# EAGLE design Propeller-HAT (EAGLE 6.6.0)
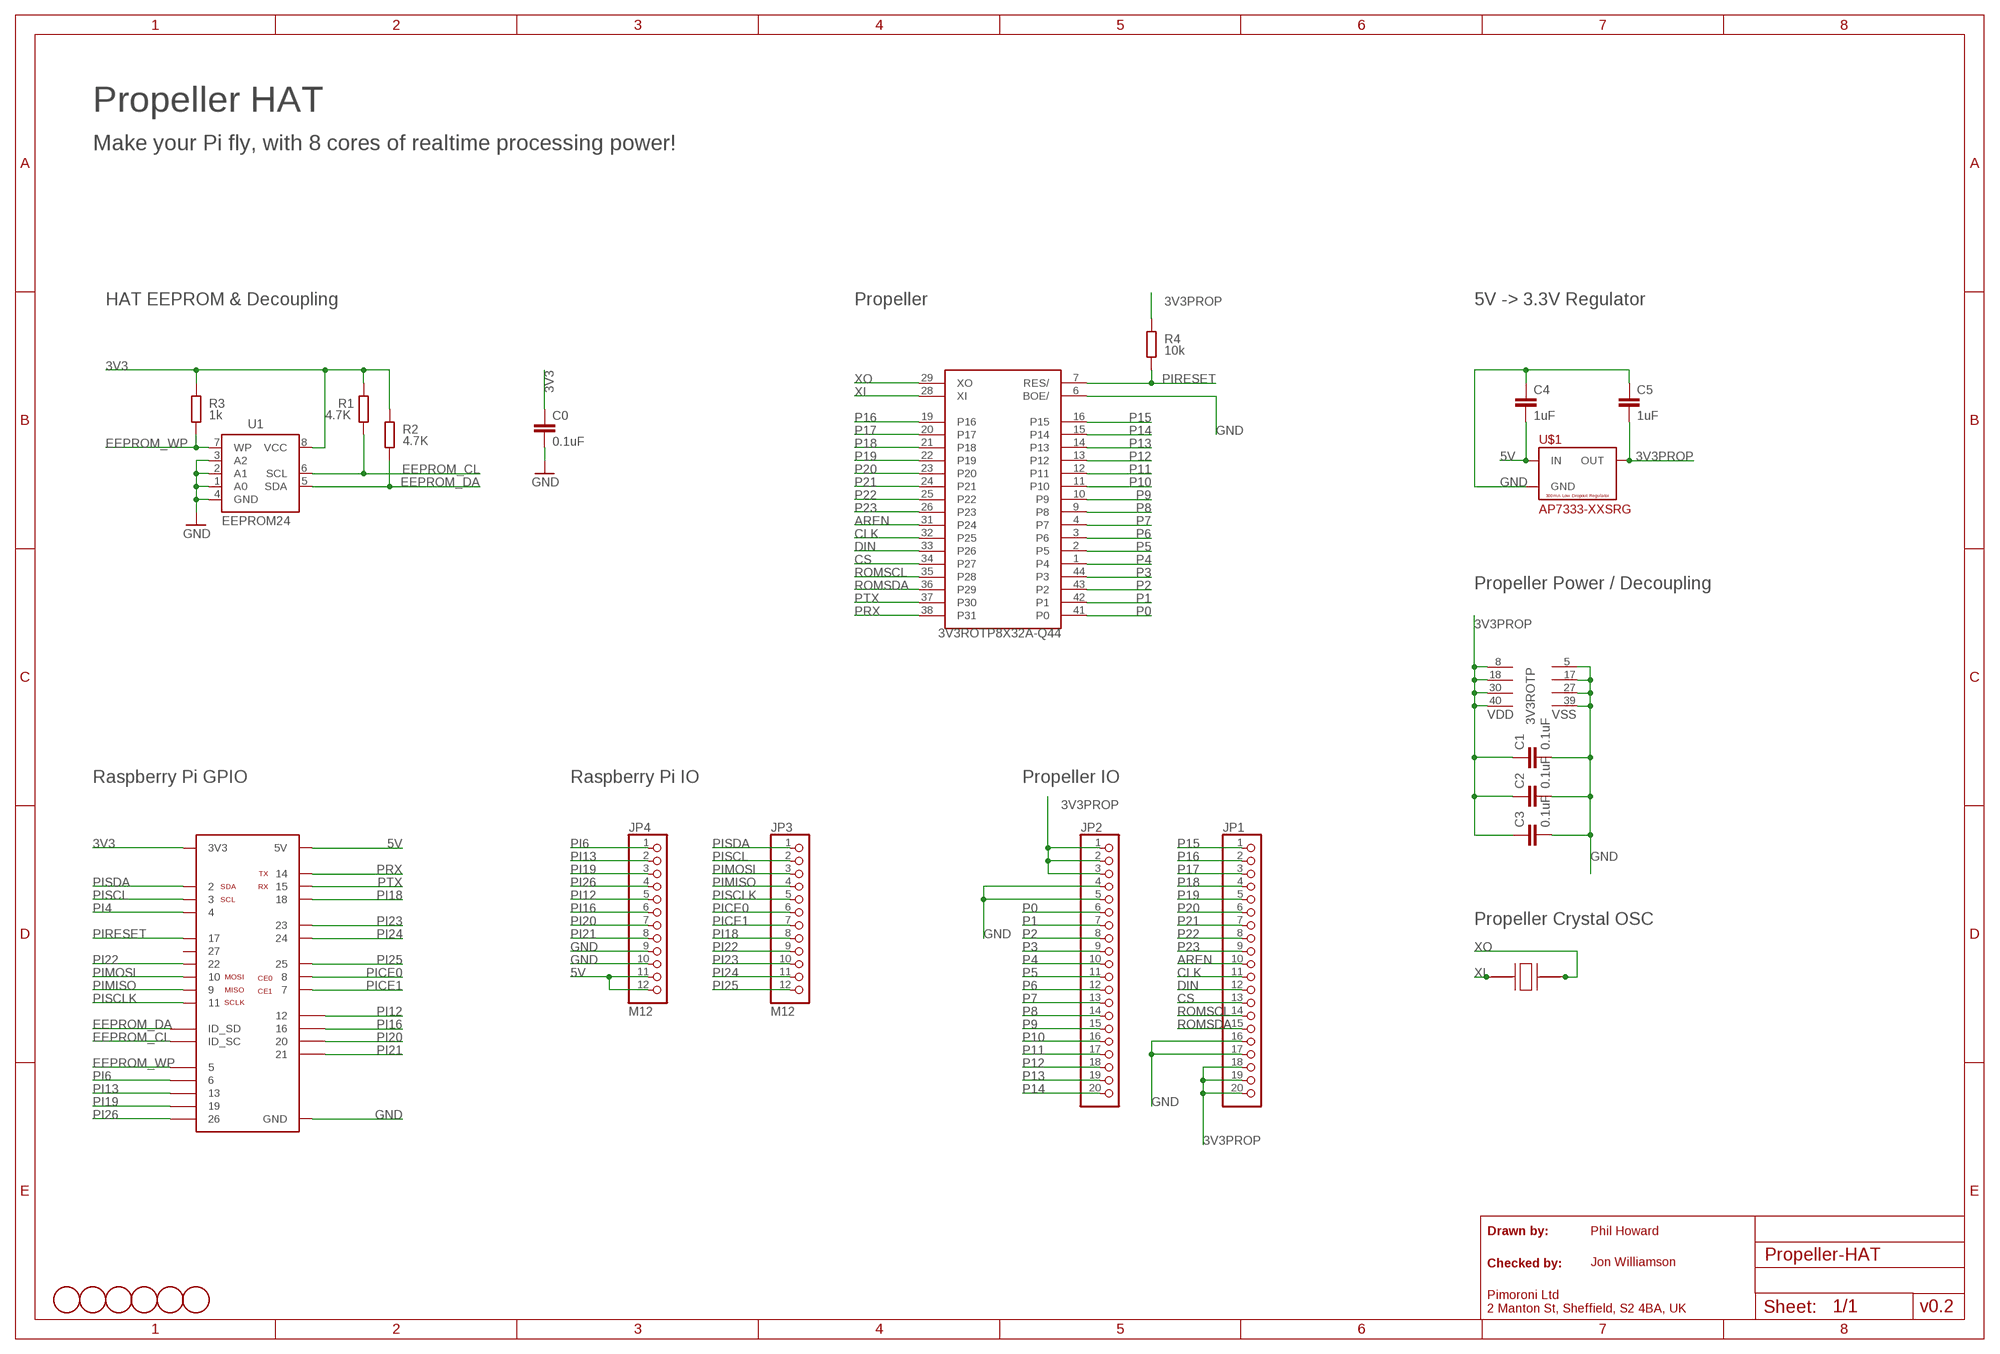
[diagram p0: schematic, sheet 1]

## Parts
3V3ROT  P8X32A-Q44  [P8X32A-Q44]
C0  0.1uF  C-EUC0603K  [C0603K]
C1  0.1uF  C-EUC0603K  [C0603K]
C2  0.1uF  C-EUC0603K  [C0603K]
C3  0.1uF  C-EUC0603K  [C0603K]
C4  1uF  C-EUC0603K  [C0603K]
C5  1uF  C-EUC0603K  [C0603K]
JP1  PINHD-1X20-BIG  [1X20-BIG]
JP2  PINHD-1X20-BIG  [1X20-BIG]
JP3  M12  [M12]
JP4  M12  [M12]
R1  4.7K  R-EU_R0603  [R0603]
R2  4.7K  R-EU_R0603  [R0603]
R3  1k  R-EU_R0603  [R0603]
R4  10k  R-EU_R0603  [R0603]
U1  EEPROM24  [SOIC8]
U$1  AP7333-XXSRG  [SOT23]
U$2  RPIGPIOPINHD-2X20-SMD-FLIPPED  [FCI_89898_313LF_40P_CONNECTOR_SMT_FLIPPED]
U$3  FIDUCIAL1MM  [FIDUCIAL-1MM]
U$4  FIDUCIAL1MM  [FIDUCIAL-1MM]
U$5  FIDUCIAL1MM  [FIDUCIAL-1MM]
U$6  FIDUCIAL1MM  [FIDUCIAL-1MM]
U$7  FIDUCIAL1MM  [FIDUCIAL-1MM]
U$8  FIDUCIAL1MM  [FIDUCIAL-1MM]
U$9  ABLS3-XXXMHZ-D4Y-T  [ABLS3-XXXMHZ-D4Y-T]

## Nets
3V3: C0.1 R1.2 R2.2 R3.2 U1.8(VCC) U$2.P1_3V3(3V3) U$2.P17_3V3(3V3)
3V3PROP: 3V3ROT.8(P:VDD) 3V3ROT.18(P:VDD) 3V3ROT.30(P:VDD) 3V3ROT.40(P:VDD) C1.1 C2.1 C3.1 C5.2 JP1.18 JP1.19 JP1.20 JP2.1 JP2.2 JP2.3 R4.2 U$1.2(OUT)
5V: C4.2 JP4.11 JP4.12 U$1.3(IN) U$2.P2_5V(5V) U$2.P4_5V(5V)
AREN: 3V3ROT.31(P8X32A-Q44:P24) JP1.10
CLK: 3V3ROT.32(P8X32A-Q44:P25) JP1.11
CS: 3V3ROT.34(P8X32A-Q44:P27) JP1.13
DIN: 3V3ROT.33(P8X32A-Q44:P26) JP1.12
EEPROM_CL: R1.1 U1.6(SCL) U$2.P28_IDSC(ID_SC)
EEPROM_DA: R2.1 U1.5(SDA) U$2.P27_IDSD(ID_SD)
EEPROM_WP: R3.1 U1.7(WP) U$2.P29_GPIO5
GND: 3V3ROT.5(P:VSS) 3V3ROT.6(P8X32A-Q44:BOE/) 3V3ROT.17(P:VSS) 3V3ROT.27(P:VSS) 3V3ROT.39(P:VSS) C0.2 C1.2 C2.2 C3.2 C4.1 C5.1 JP1.16 JP1.17 JP2.4 JP2.5 JP4.9 JP4.10 U1.1(A0) U1.2(A1) U1.3(A2) U1.4(GND) U$1.1(GND) U$2.P6_GND(GND) U$2.P9_GND(GND) U$2.P14_GND(GND) U$2.P20_GND(GND) U$2.P25_GND(GND) U$2.P30_GND(GND) U$2.P34_GND(GND) U$2.P39_GND(GND)
P0: 3V3ROT.41(P8X32A-Q44:P0) JP2.6
P1: 3V3ROT.42(P8X32A-Q44:P1) JP2.7
P2: 3V3ROT.43(P8X32A-Q44:P2) JP2.8
P3: 3V3ROT.44(P8X32A-Q44:P3) JP2.9
P4: 3V3ROT.1(P8X32A-Q44:P4) JP2.10
P5: 3V3ROT.2(P8X32A-Q44:P5) JP2.11
P6: 3V3ROT.3(P8X32A-Q44:P6) JP2.12
P7: 3V3ROT.4(P8X32A-Q44:P7) JP2.13
P8: 3V3ROT.9(P8X32A-Q44:P8) JP2.14
P9: 3V3ROT.10(P8X32A-Q44:P9) JP2.15
P10: 3V3ROT.11(P8X32A-Q44:P10) JP2.16
P11: 3V3ROT.12(P8X32A-Q44:P11) JP2.17
P12: 3V3ROT.13(P8X32A-Q44:P12) JP2.18
P13: 3V3ROT.14(P8X32A-Q44:P13) JP2.19
P14: 3V3ROT.15(P8X32A-Q44:P14) JP2.20
P15: 3V3ROT.16(P8X32A-Q44:P15) JP1.1
P16: 3V3ROT.19(P8X32A-Q44:P16) JP1.2
P17: 3V3ROT.20(P8X32A-Q44:P17) JP1.3
P18: 3V3ROT.21(P8X32A-Q44:P18) JP1.4
P19: 3V3ROT.22(P8X32A-Q44:P19) JP1.5
P20: 3V3ROT.23(P8X32A-Q44:P20) JP1.6
P21: 3V3ROT.24(P8X32A-Q44:P21) JP1.7
P22: 3V3ROT.25(P8X32A-Q44:P22) JP1.8
P23: 3V3ROT.26(P8X32A-Q44:P23) JP1.9
PI4: U$2.P7_GPIO4
PI6: JP4.1 U$2.P31_GPIO6
PI12: JP4.5 U$2.P32_GPIO12
PI13: JP4.2 U$2.P33_GPIO13
PI16: JP4.6 U$2.P36_GPIO16
PI18: JP3.8 U$2.P12_GPIO18
PI19: JP4.3 U$2.P35_GPIO19
PI20: JP4.7 U$2.P38_GPIO20
PI21: JP4.8 U$2.P40_GPIO21
PI22: JP3.9 U$2.P15_GPIO22
PI23: JP3.10 U$2.P16_GPIO23
PI24: JP3.11 U$2.P18_GPIO24
PI25: JP3.12 U$2.P22_GPIO25
PI26: JP4.4 U$2.P37_GPIO26
PICE0: JP3.6 U$2.P24_GPIO8_SPI0_CE0
PICE1: JP3.7 U$2.P26_GPIO7_SPI0_CE1
PIMISO: JP3.4 U$2.P21_GPIO9_SPI0_MISO
PIMOSI: JP3.3 U$2.P19_GPIO10_SPI0_MOSI
PIRESET: 3V3ROT.7(P8X32A-Q44:RES/) R4.1 U$2.P11_GPIO17
PISCL: JP3.2 U$2.P5_GPIO3_SCL
PISCLK: JP3.5 U$2.P23_GPIO11_SPI0_SCLK
PISDA: JP3.1 U$2.P3_GPIO2_SDA
PRX: 3V3ROT.38(P8X32A-Q44:P31) U$2.P8_GPIO14_UART0_TXD
PTX: 3V3ROT.37(P8X32A-Q44:P30) U$2.P10_GPIO15_UART0_RXD
ROMSCL: 3V3ROT.35(P8X32A-Q44:P28) JP1.14
ROMSDA: 3V3ROT.36(P8X32A-Q44:P29) JP1.15
XI: 3V3ROT.28(P8X32A-Q44:XI) U$9.P$1
XO: 3V3ROT.29(P8X32A-Q44:XO) U$9.P$2
Unconnected: U$2.P13_GPIO27

## Notes on the sheet
- Propeller HAT
- Make your Pi fly, with 8 cores of realtime processing power!
- HAT EEPROM & Decoupling | Propeller | 5V -> 3.3V Regulator
- Propeller Power / Decoupling
- Raspberry Pi GPIO | Raspberry Pi IO | Propeller IO
- Propeller Crystal OSC
- Drawn by: | Phil Howard
- Checked by: | Jon Williamson
- Pimoroni Ltd
  2 Manton St, Sheffield, S2 4BA, UK
- v0.2

## Library data of the parts
3V3ROT = SparkFun-DigitalIC:P8X32A-Q44: Propellor uC
C0 C1-C5 = resistor:C-EU: CAPACITOR, European symbol
JP1 JP2 = adafruit:PINHD-1X20: PIN HEADER
JP3 JP4 = pimoroni:M12
R1-R4 = resistor:R-EU_: RESISTOR, European symbol; TOLERANCE: 5%
U1 = FLYFISH:EEPROM24
U$1 = pimoroni:AP7333: The AP7333 is a 300mA, fixed output voltage, low dropout linear regulator. The device included pass element, error amplifier, band-gap, current limit and thermal shutdown circuitry. The characteristics of low dropout voltage and low quiescent current make it suitable for low power applications, for example, battery powered devices. The typical quiescent current is approximately 65μA. Built-in current-limit and thermal-shutdown functions prevent IC from damage in fault conditions. The AP7333 is available in SOT23 packages with different pin-outs.
U$2 = pimoroni:RPIGPIOPINHD-2X20-SMD-FLIPPED
U$3-U$8 = pimoroni:FIDUCIAL: 2mm fiducial for pick and place
U$9 = pimoroni:ABLS3-XXXMHZ-D4Y-T

## Board
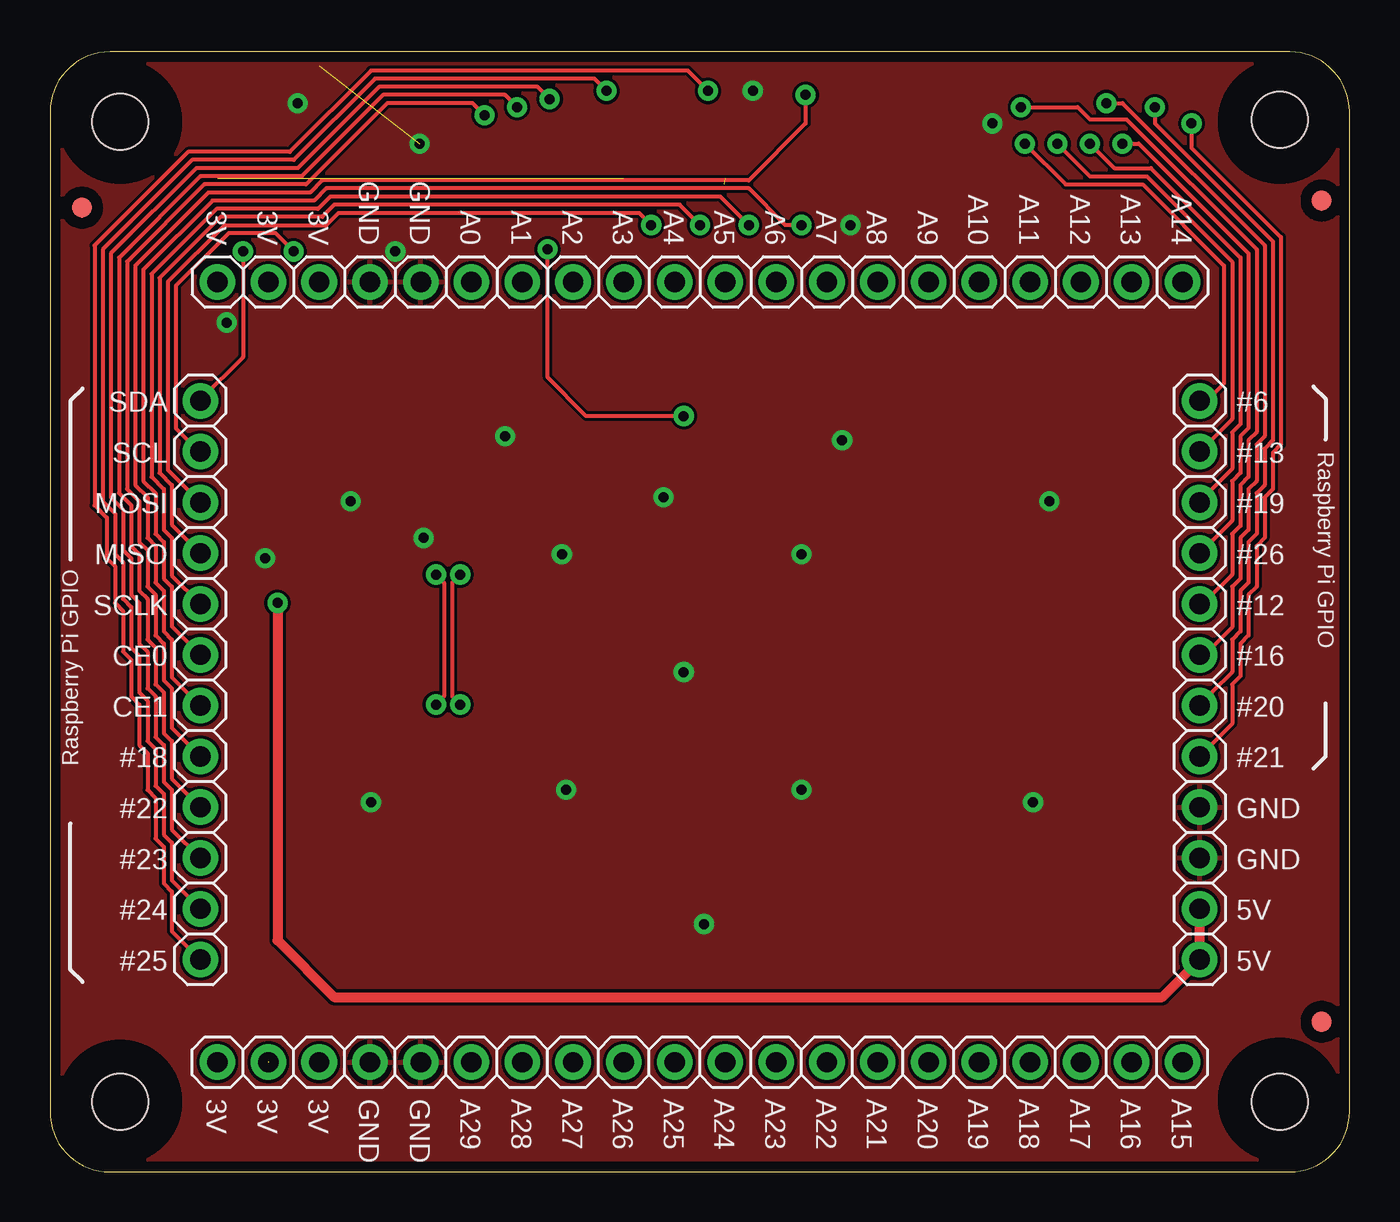
[diagram p1: board, top side]
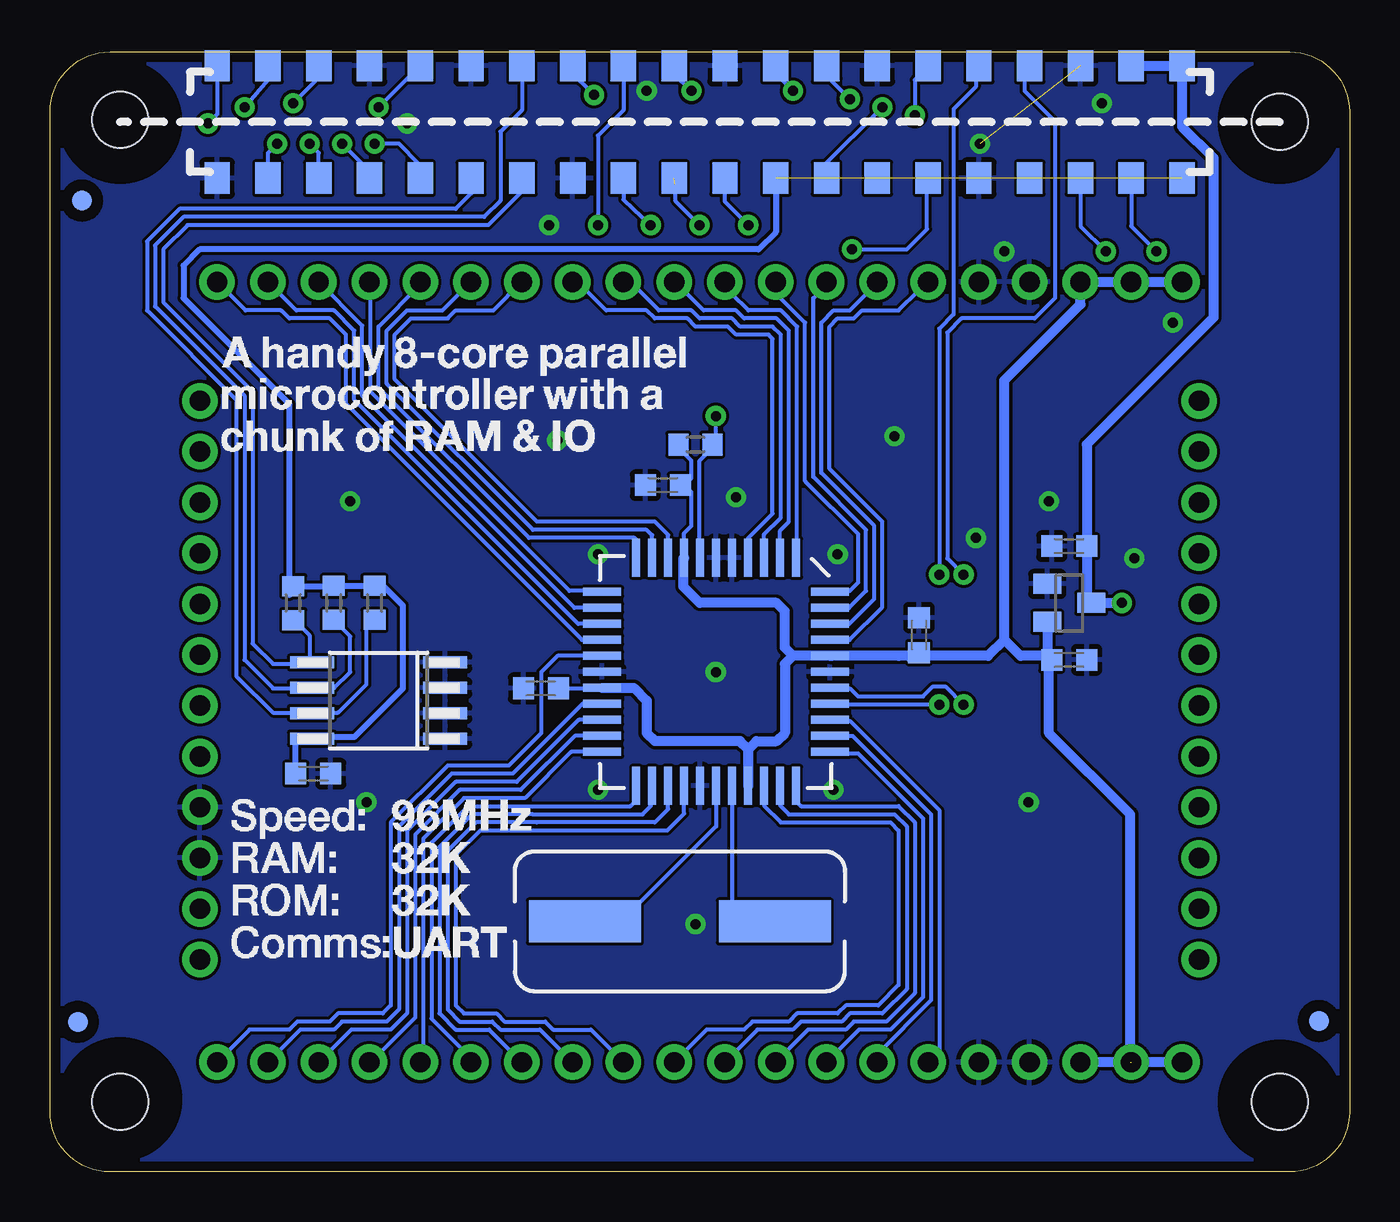
[diagram p2: board, bottom side, seen from below]

Size 65 x 56 mm. Coordinates in mm from the lower left corner, seen from the top.
Outline: 65,53 arc90 62,56 3,56 arc90 0,53 0,3 arc90 3,0 62,0 arc90 65,3 65,53
Copper layers (1*16): Top 0.035mm / dielectric 1.5mm / Bottom 0.035mm
Design rules "pimoroni": minimum track width 8mil, minimum drill 12mil, track to track 6mil, track to pad 6mil, pad to pad 6mil, via to via 6mil, smd to smd 6mil, copper to edge 20mil, drill to drill 6mil, minimum pad ring 12mil, minimum via ring 10mil, stop-mask expansion 1mil, vias tented up to drill 25mil, thermal gap 10mil
Holes 2.8 mm at 61.5,52.6 61.5,3.5 3.5,3.5 3.5,52.5
tRestrict: area 60,2 to 63,5.2; area 1.9,1.9 to 5,5; area 1.9,51 to 5,54; area 60,51 to 63,54.1
bRestrict: area 60,51 to 63,54; area 59.9,2.1 to 63,5.2; area 1.9,51 to 5,54; area 1.9,1.9 to 5,5

### Footprints (pad centres in the part's own frame; a part is rotated, then mirrored left to right if it is on the bottom)
P8X32A-Q44 = smd 1.9 x 0.4: 1 -5.713,4.013; 2 -5.713,3.212; 3 -5.713,2.413; 4 -5.713,1.613; 5 -5.713,0.812; 6 -5.713,0.013; 7 -5.713,-0.787; 8 -5.713,-1.587; 9 -5.713,-2.388; 10 -5.713,-3.188; 11 -5.713,-3.987; 23 5.688,-3.987; 24 5.688,-3.188; 25 5.688,-2.388; 26 5.688,-1.587; 27 5.688,-0.787; 28 5.688,0.013; 29 5.688,0.812; 30 5.688,1.613; 31 5.688,2.413; 32 5.688,3.212; 33 5.688,4.013 | smd 0.4 x 1.9: 12 -4.013,-5.688; 13 -3.212,-5.688; 14 -2.413,-5.688; 15 -1.613,-5.688; 16 -0.812,-5.688; 17 -0.013,-5.688; 18 0.787,-5.688; 19 1.587,-5.688; 20 2.388,-5.688; 21 3.188,-5.688; 22 3.987,-5.688; 34 3.987,5.713; 35 3.188,5.713; 36 2.388,5.713; 37 1.587,5.713; 38 0.787,5.713; 39 -0.013,5.713; 40 -0.812,5.713; 41 -1.613,5.713; 42 -2.413,5.713; 43 -3.212,5.713; 44 -4.013,5.713
C0603K = smd 1.05 x 1.08: 1 -0.875,0; 2 0.875,0
1X20-BIG = drill 1.016 pad 1.778: 1 -24.13,0; 2 -21.59,0; 3 -19.05,0; 4 -16.51,0; 5 -13.97,0; 6 -11.43,0; 7 -8.89,0; 8 -6.35,0; 9 -3.81,0; 10 -1.27,0; 11 1.27,0; 12 3.81,0; 13 6.35,0; 14 8.89,0; 15 11.43,0; 16 13.97,0; 17 16.51,0; 18 19.05,0; 19 21.59,0; 20 24.13,0
M12 = drill 1.016 pad 1.778: 1 -13.97,0; 2 -11.43,0; 3 -8.89,0; 4 -6.35,0; 5 -3.81,0; 6 -1.27,0; 7 1.27,0; 8 3.81,0; 9 6.35,0; 10 8.89,0; 11 11.43,0; 12 13.97,0
R0603 = smd 1 x 1.1: 1 -0.85,0; 2 0.85,0
SOIC8 = smd 0.6 x 2.2: 1 -1.905,-3.33; 2 -0.635,-3.33; 3 0.635,-3.33; 4 1.905,-3.33; 5 1.905,3.33; 6 0.635,3.33; 7 -0.635,3.33; 8 -1.905,3.33
SOT23 = smd 1 x 1.4: 1 -0.95,-1.1; 2 0.95,-1.1; 3 0,1.1
FCI_89898_313LF_40P_CONNECTOR_SMT_FLIPPED = smd 1.27 x 1.57: P1_3V3 24.13,-2.81; P2_5V 24.13,2.81; P3_GPIO2_SDA 21.59,-2.81; P4_5V 21.59,2.81; P5_GPIO3_SCL 19.05,-2.81; P6_GND 19.05,2.81; P7_GPIO4 16.51,-2.81; P8_GPIO14_UART0_TXD 16.51,2.81; P9_GND 13.97,-2.81; P10_GPIO15_UART0_RXD 13.97,2.81; P11_GPIO17 11.43,-2.81; P12_GPIO18 11.43,2.81; P13_GPIO27 8.89,-2.81; P14_GND 8.89,2.81; P15_GPIO22 6.35,-2.81; P16_GPIO23 6.35,2.81; P17_3V3 3.81,-2.81; P18_GPIO24 3.81,2.81; P19_GPIO10_SPI0_MOSI 1.27,-2.81; P20_GND 1.27,2.81; P21_GPIO9_SPI0_MISO -1.27,-2.81; P22_GPIO25 -1.27,2.81; P23_GPIO11_SPI0_SCLK -3.81,-2.81; P24_GPIO8_SPI0_CE0 -3.81,2.81; P25_GND -6.35,-2.81; P26_GPIO7_SPI0_CE1 -6.35,2.81; P27_IDSD -8.89,-2.81; P28_IDSC -8.89,2.81; P29_GPIO5 -11.43,-2.81; P30_GND -11.43,2.81; P31_GPIO6 -13.97,-2.81; P32_GPIO12 -13.97,2.81; P33_GPIO13 -16.51,-2.81; P34_GND -16.51,2.81; P35_GPIO19 -19.05,-2.81; P36_GPIO16 -19.05,2.81; P37_GPIO26 -21.59,-2.81; P38_GPIO20 -21.59,2.81; P39_GND -24.13,-2.81; P40_GPIO21 -24.13,2.81
FIDUCIAL-1MM = smd 1 x 1: 1 0,0
ABLS3-XXXMHZ-D4Y-T = smd 5.6 x 2.1: P$1 0,0; P$2 9.5,0

### Placement (x,y rotation side)
3V3ROT  31.7,24.99 270 bottom
C0  51.83,19.91 0 bottom
C1  21.54,26.84 90 bottom
C2  34.34,34.34 180 bottom
C3  40.44,24.18 180 bottom
C4  14.02,31.29 0 bottom
C5  14.02,25.6 180 bottom
JP1  32.51,5.49 180 top
JP2  32.51,44.5 0 top
JP3  7.52,24.59 270 top
JP4  57.51,24.59 270 top
R1  50.8,28.45 90 bottom
R2  52.83,28.45 90 bottom
R3  48.77,28.45 90 bottom
R4  32.71,36.37 180 bottom
U1  48.57,23.57 90 bottom
U$1  14.02,28.45 270 bottom
U$2  32.51,52.5 0 bottom
U$3  1.53,7.54 0 bottom
U$4  63.61,7.51 0 bottom
U$5  63.4,48.57 0 bottom
U$6  1.6,48.21 0 top
U$7  63.6,48.57 0 top
U$8  63.6,7.51 0 top
U$9  38.24,12.53 0 bottom

### Tracks (layer width: path | path; a pad name or v marks a point on that pad's centre or on a via)
3V3  (1 unrouted)
  Bottom 0.305: U$2.P17_3V3 28.7,47 29.57,46.13 57.51,46.13 58.32,45.31 58.32,43.69 53.03,38.41 53.03,28.85 52.83,29.26 52.87,29.26 R2.2 R1.2 R3.2 48.33,29.3 47.35,28.32 47.35,24.18 49.78,21.74 51.82,21.74 U1.8 51.97,21.74 52.43,21.74 52.7,21.47 C0.1
3V3PROP  (1 unrouted)
  Bottom 0.203: C3.1 37.41,24.18 3V3ROT.18 | 3V3ROT.8 33.29,31.94 32.92,32.31 32.92,33.99 33.33,34.34 | C2.1 33.33,34.34 | 33.33,34.34 32.92,34.69 32.92,35.56 33.56,36.21 R4.2
  Bottom 0.508: U$1.2 15.12,25.83 15.1,25.81 | 25.91,25.79 3V3ROT.40 | 3V3ROT.40 27.84,25.81 | 27.84,25.81 28.25,26.21 28.25,28.04 28.65,28.45 32.51,28.45 33.33,29.26 33.33,30.67 3V3ROT.8 | 27.84,25.81 28.25,25.4 28.25,21.95 28.65,21.54 29.67,21.54 30.07,21.13 | 3V3ROT.18 35.79,24.21 35.15,23.57 35.15,21.95 34.75,21.54 30.48,21.54 30.07,21.13 | 15.51,27.5 U$1.2 | JP2.1 JP2.2 JP2.3 13.46,43.38 17.27,39.57 17.27,26.62 | JP1.20 10.97,5.49 | 10.97,5.49 JP1.18 | 14.85,27.23 U$1.2 | 10.97,5.49 10.97,17.88 15.04,21.95 15.04,25.46 C5.2 15.1,25.81 | 15.1,25.81 16.46,25.81 17.27,26.62 | 3V3ROT.30 30.07,19.32 30.07,21.13 | 17.27,26.62 18.09,25.81 21.59,25.81 | 21.59,25.81 21.95,25.81 | 21.95,25.81 22,25.76 C1.1 21.59,25.81 | 21.95,25.81 22.55,25.81 3V3ROT.40
5V  (via drill 0.5)
  Top 0.508: v11.38,28.45 11.38,11.58 14.22,8.74 55.63,8.74 JP4.12 JP4.11
  Bottom 0.508: U$2.P4_5V U$2.P2_5V 8.38,52.27 6.81,50.7 6.81,42.71 13.15,36.37 C4.2 13.15,28.67 | 13.15,28.67 U$1.3 | 13.15,28.67 13.03,28.67 12.8,28.45 v11.38,28.45
AREN
  Bottom 0.203: 3V3ROT.31 29.29,18.31 28.45,17.48 22.96,17.48 22.55,17.07 22.55,9.35 23.57,8.33 25.2,8.33 25.6,7.92 27.64,7.92 28.04,7.52 29.87,7.52 30.28,7.11 32.16,7.11 JP1.10
CLK
  Bottom 0.203: 3V3ROT.32 28.49,18.33 28.04,17.88 22.76,17.88 22.15,17.27 22.15,9.14 23.37,7.92 24.99,7.92 25.4,7.52 27.43,7.52 27.84,7.11 29.62,7.11 JP1.11
CS
  Bottom 0.203: JP1.13 24.54,7.11 22.96,7.11 21.34,8.74 21.34,17.68 24.59,20.93 26.01,20.93 25.32,21.01 3V3ROT.34
DIN
  Bottom 0.203: 3V3ROT.33 27.69,18.54 27.43,18.29 22.55,18.29 21.74,17.48 21.74,8.94 23.16,7.52 24.79,7.52 25.2,7.11 27.08,7.11 JP1.12
EEPROM_CL
  Bottom 0.203: U$2.P28_IDSC 41.4,53.09 42.47,52.02 42.47,48.56 43.28,47.75 58.32,47.75 59.74,46.33 59.74,43.28 55.27,38.81 55.27,25.6 53.85,24.18 51.92,24.18 U1.6 50.78,24.2 49.99,24.99 49.99,26.78 R1.1
EEPROM_DA
  Bottom 0.203: U$2.P27_IDSD 41.4,49.03 43.08,47.35 58.12,47.35 59.33,46.13 59.33,43.48 54.86,39.01 54.86,26.42 53.85,25.4 51.97,25.4 U1.5 | 52.02,25.6 U1.5 | R2.1 52.79,27.6 52.02,26.82 52.02,25.6 U1.5
EEPROM_WP
  Bottom 0.203: U$2.P29_GPIO5 43.94,48.93 44.7,48.16 58.52,48.16 60.15,46.53 60.15,43.08 55.68,38.61 55.68,24.79 53.85,22.96 51.92,22.96 U1.7 51.03,22.93 50.8,22.96 50.6,22.96 49.17,24.38 49.17,27.19 R3.1
GND  (via drill 0.5)  (1 unrouted)
  other vias: 15.04,33.53 16.05,18.49 22.76,36.78 39.62,36.58 49.17,18.49 32.72,12.4 49.99,33.53 47.14,52.43 12.4,53.44 31.7,24.99 40.03,47.35 18.49,51.41 35.15,54.05 8.84,42.47 30.68,33.73 18.69,31.7 25.81,19.1 37.59,19.1 10.77,30.68 17.27,46.02 25.6,30.89 37.59,30.89
  pour Top (rank 2): -1,57 66,57 66,-1 -1,-1
  pour Bottom (rank 2): -2,58 67,58 67,-2 -2,-2
P0
  Bottom 0.203: 3V3ROT.41 25.01,26.61 23.37,28.25 23.37,32.51 26.01,35.15 26.01,42.27 25.6,42.67 24.79,42.67 24.38,43.08 22.55,43.08 21.54,44.09 21.49,44.09 JP2.6
P1
  Bottom 0.203: 3V3ROT.42 25.02,27.41 23.77,28.65 23.77,32.31 26.42,34.95 26.42,42.47 25.81,43.08 24.99,43.08 23.98,44.09 23.98,44.15 JP2.7
P2
  Bottom 0.203: 3V3ROT.43 25.03,28.21 24.18,29.06 24.18,32.11 26.82,34.75 26.82,43.69 26.42,44.09 26.42,44.25 JP2.8
P3
  Bottom 0.203: 26.62,29.06 26.57,29.01 3V3ROT.44 25.94,29.06 24.99,29.06 24.59,29.46 24.59,31.9 27.23,34.54 27.23,42.47 28.65,43.89 28.65,44.45 JP2.9
P4
  Bottom 0.203: 3V3ROT.1 27.69,31.24 27.64,31.29 27.64,42.27 28.45,43.08 30.07,43.08 30.89,43.89 30.89,44.15 JP2.10
P5
  Bottom 0.203: 3V3ROT.2 28.49,32.07 28.04,32.51 28.04,42.06 28.65,42.67 30.28,42.67 30.68,43.08 32.31,43.08 33.33,44.09 33.38,44.09 JP2.11
P6
  Bottom 0.203: 3V3ROT.3 29.29,31.88 28.45,32.72 28.45,41.86 28.85,42.27 30.48,42.27 30.89,42.67 32.51,42.67 32.92,43.08 34.54,43.08 35.76,44.3 36.12,44.3 JP2.12
P7
  Bottom 0.203: 3V3ROT.4 30.09,31.69 28.85,32.92 28.85,41.66 29.06,41.86 30.68,41.86 31.09,42.27 32.72,42.27 33.12,42.67 34.75,42.67 35.15,43.08 37.19,43.08 38.41,44.3 38.66,44.3 JP2.13
P8
  Bottom 0.203: 3V3ROT.9 34.09,31.85 34.75,32.51 40.64,32.51 47.75,39.62 47.75,41.86 46.94,42.67 45.11,42.67 44.7,43.08 42.82,43.08 JP2.14
P9
  Bottom 0.203: 3V3ROT.10 34.89,31.84 35.15,32.11 40.84,32.11 48.16,39.42 48.16,42.06 47.14,43.08 45.36,43.08 JP2.15
P10
  Bottom 0.203: 3V3ROT.11 35.69,31.62 35.76,31.7 41.05,31.7 48.56,39.22 48.56,42.27 46.48,44.35 JP2.16
P11
  Bottom 0.203: 3V3ROT.12 37.44,29.06 39.01,29.06 48.97,39.01 48.97,43.89 49.02,43.94 JP2.17 48.97,44.45
P12
  Bottom 0.203: 3V3ROT.13 38.77,28.21 49.38,38.81 49.38,42.32 JP2.18
P13
  Bottom 0.203: 3V3ROT.14 38.58,27.41 49.78,38.61 49.78,42.06 50.8,43.08 52.68,43.08 JP2.19
P14
  Bottom 0.203: 3V3ROT.15 38.39,26.61 50.19,38.41 50.19,41.86 51,42.67 53.03,42.67 53.44,43.08 55.22,43.08 JP2.20
P15
  Bottom 0.203: 3V3ROT.16 39.62,25.81 40.44,24.99 40.44,21.95 42.06,20.32 45.11,20.32 47.95,17.48 47.95,8.33 48.36,7.92 50.6,7.92 51,7.52 52.63,7.52 53.03,7.11 55.02,7.11 JP1.1
P16
  Bottom 0.203: 3V3ROT.19 38.37,23.41 41.86,19.91 44.91,19.91 47.55,17.27 47.55,8.13 48.16,7.52 50.39,7.52 50.8,7.11 52.48,7.11 JP1.2
P17
  Bottom 0.203: 3V3ROT.20 38.56,22.61 41.66,19.51 44.7,19.51 47.14,17.07 47.14,7.92 47.95,7.11 49.94,7.11 JP1.3
P18
  Bottom 0.203: 3V3ROT.21 38.75,21.81 41.45,19.1 44.5,19.1 46.74,16.87 46.74,7.72 48.56,5.89 48.62,5.89 JP1.4
P19
  Bottom 0.203: 3V3ROT.22 38.94,21.01 41.25,18.69 44.3,18.69 46.33,16.66 46.33,5.84 JP1.5
P20
  Bottom 0.203: 3V3ROT.23 35.77,19.92 35.76,18.49 35.97,18.29 44.09,18.29 45.92,16.46 45.92,7.67 43.94,5.69 JP1.6
P21
  Bottom 0.203: JP1.7 43.03,7.11 44.7,7.11 45.52,7.92 45.52,13.21 45.52,16.26 43.89,17.88 43.28,17.88 40.84,17.88 35.36,17.88 34.95,18.29 34.95,18.69 34.89,18.76 3V3ROT.24
P22
  Bottom 0.203: JP1.8 40.49,7.11 42.47,7.11 42.88,7.52 44.5,7.52 45.11,8.13 45.11,13.01 45.11,16.05 43.69,17.48 40.64,17.48 34.75,17.48 34.09,18.14 3V3ROT.25
P23
  Bottom 0.203: JP1.9 37.95,7.11 39.83,7.11 40.23,7.52 42.27,7.52 42.67,7.92 44.3,7.92 44.7,8.33 44.7,15.85 43.48,17.07 34.14,17.07 33.29,17.92 3V3ROT.26
PI6  (via drill 0.5)
  Top 0.203: v48.77,51.41 50.8,49.38 54.66,49.38 58.73,45.31 58.73,39.42 57.71,38.41 57.35,38.41 JP4.1
  Bottom 0.203: U$2.P31_GPIO6 46.53,49.99 | 46.53,49.99 | 46.53,49.99 46.53,50.39 47.55,51.41 v48.77,51.41
PI12  (via drill 0.5)
  Top 0.203: v48.56,53.24 51.41,53.24 52.02,52.63 53.85,52.63 60.35,46.13 60.35,36.98 59.94,36.58 59.94,34.75 59.54,34.34 59.54,32.31 59.13,31.9 59.13,29.87 57.91,28.65 57.56,28.25 JP4.5
  Bottom 0.203: U$2.P32_GPIO12 47.09,54.72 v48.56,53.24
PI13  (via drill 0.5)
  Top 0.203: v50.39,51.41 52.02,49.78 54.86,49.78 59.13,45.52 59.13,37.64 JP4.2
  Bottom 0.203: U$2.P33_GPIO13 49.02,50.03 v50.39,51.41
PI16  (via drill 0.5)
  Top 0.203: v52.83,53.44 53.65,53.44 60.76,46.33 60.76,36.78 60.35,36.37 60.35,34.54 59.94,34.14 59.94,32.11 59.54,31.7 59.54,29.67 59.13,29.26 59.13,27.23 57.91,26.01 57.66,25.81 JP4.6 57.56,25.81
  Bottom 0.203: U$2.P36_GPIO16 51.56,54.72 v52.83,53.44
PI18  (via drill 0.5)
  Top 0.203: v21.74,52.83 21.13,53.44 16.87,53.44 12.8,49.38 7.72,49.38 3.86,45.52 3.86,34.14 4.47,33.53 4.47,31.5 4.88,31.09 4.88,29.26 5.28,28.85 5.28,26.82 5.69,26.42 5.69,24.59 6.1,24.18 6.1,22.2 JP3.8
  Bottom 0.203: U$2.P12_GPIO18 21.74,54.6 v21.74,52.83
PI19  (via drill 0.5)
  Top 0.203: v52.02,51.41 53.24,50.19 55.07,50.19 59.54,45.72 59.54,37.39 59.13,36.98 59.13,35.15 57.91,33.93 JP4.3 57.35,33.33
  Bottom 0.203: U$2.P35_GPIO19 51.56,50.95 v52.02,51.41
PI20  (via drill 0.5)
  Top 0.203: v55.27,53.24 55.27,52.43 61.16,46.53 61.16,36.58 60.76,36.17 60.76,34.34 60.35,33.93 60.35,31.9 59.94,31.5 59.94,29.46 59.54,29.06 59.54,27.03 59.13,26.62 59.13,24.99 58.12,23.98 57.56,23.37 JP4.7
  Bottom 0.203: U$2.P38_GPIO20 54.1,54.62 v55.27,53.24
PI21  (via drill 0.5)
  Top 0.203: v57.1,52.43 57.1,51.21 61.57,46.74 61.57,36.37 61.16,35.97 61.16,34.14 60.76,33.73 60.76,31.7 60.35,31.29 60.35,29.26 59.94,28.85 59.94,26.82 59.54,26.42 59.54,24.79 59.13,24.38 59.13,22.4 JP4.8
  Bottom 0.203: U$2.P40_GPIO21 56.64,52.89 v57.1,52.43
PI22  (via drill 0.5)
  Top 0.203: v23.37,53.24 22.76,53.85 16.66,53.85 12.6,49.78 7.52,49.78 3.45,45.72 3.45,33.93 4.06,33.33 4.06,31.29 4.47,30.89 4.47,29.06 4.88,28.65 4.88,26.62 5.28,26.21 5.28,24.38 5.69,23.98 5.69,21.95 6.1,21.54 6.1,19.66 JP3.9
  Bottom 0.203: U$2.P15_GPIO22 26.36,50.25 v23.37,53.24
PI23  (via drill 0.5)
  Top 0.203: v24.99,53.65 24.38,54.25 16.46,54.25 12.39,50.19 7.32,50.19 3.05,45.92 3.05,33.73 3.66,33.12 3.66,31.09 4.06,30.68 4.06,28.85 4.47,28.45 4.47,26.42 4.88,26.01 4.88,24.18 5.28,23.77 5.28,21.74 5.69,21.34 5.69,19.51 6.1,19.1 6.1,17.12 JP3.10
  Bottom 0.203: U$2.P16_GPIO23 26.21,55.26 25.81,54.86 25.6,54.66 26.01,54.66 v24.99,53.65
PI24  (via drill 0.5)
  Top 0.203: v27.84,54.05 27.23,54.66 16.26,54.66 12.19,50.6 7.11,50.6 2.64,46.13 2.64,33.53 3.25,32.92 3.25,30.89 3.66,30.48 3.66,28.65 4.06,28.25 4.06,26.21 4.47,25.81 4.47,23.98 4.88,23.57 4.88,21.54 5.28,21.13 5.28,19.3 5.69,18.9 5.69,16.87 6.1,16.46 6.1,14.58 JP3.11
  Bottom 0.203: U$2.P18_GPIO24 28.49,54.71 v27.84,54.05
PI25  (via drill 0.5)
  Top 0.203: v32.92,54.05 31.9,55.07 16.05,55.07 11.99,51 6.91,51 2.23,46.33 2.23,33.33 2.85,32.72 2.85,30.68 3.25,30.28 3.25,28.45 3.66,28.04 3.66,26.01 4.06,25.6 4.06,23.77 4.47,23.37 4.47,21.34 4.88,20.93 4.88,19.1 5.28,18.69 5.28,16.66 5.69,16.26 5.69,14.43 6.1,14.02 6.1,12.04 JP3.12
  Bottom 0.203: U$2.P22_GPIO25 34.18,55.23 v32.92,54.05
PI26  (via drill 0.5)
  Top 0.203: v53.65,51.41 54.46,51.41 59.94,45.92 59.94,37.19 59.54,36.78 59.54,34.95 59.13,34.54 59.13,32.56 JP4.4
  Bottom 0.203: U$2.P37_GPIO26 54.1,50.96 v53.65,51.41
PICE0  (via drill 0.5)
  Top 0.203: v37.59,47.35 36.78,47.35 34.95,49.17 13.82,49.17 13.21,48.56 8.13,48.56 4.67,45.11 4.67,34.54 5.28,33.93 5.28,31.9 5.69,31.5 5.69,29.67 6.1,29.26 6.1,27.28 JP3.6
  Bottom 0.203: U$2.P24_GPIO8_SPI0_CE0 36.32,53.09 37.59,51.82 v37.59,47.35
PICE1  (via drill 0.5)
  Top 0.203: v37.8,53.85 37.8,52.43 34.95,49.58 13.61,49.58 13.01,48.97 7.92,48.97 4.27,45.31 4.27,34.34 4.88,33.73 4.88,31.7 5.28,31.29 5.28,29.46 5.69,29.06 5.69,27.03 6.1,26.62 6.1,24.74 JP3.7
  Bottom 0.203: U$2.P26_GPIO7_SPI0_CE1 39.06,55.11 v37.8,53.85
PIMISO  (via drill 0.5)  (1 unrouted)
  Top 0.203: v32.51,47.35 31.5,48.36 14.22,48.36 13.61,47.75 8.53,47.75 5.49,44.7 5.49,34.95 6.1,34.34 6.1,32.36 JP3.4
  Bottom 0.203: 33.73,49.38 33.73,48.56 v32.51,47.35
PIMOSI  (via drill 0.5)
  Top 0.203: JP3.3 5.89,35.1 5.89,44.5 8.74,47.35 13.82,47.35 14.43,47.95 29.46,47.95 v30.07,47.35
  Bottom 0.203: v30.07,47.35 31.24,48.51 U$2.P19_GPIO10_SPI0_MOSI
PIRESET  (via drill 0.5)
  Top 0.203: v31.7,37.8 26.82,37.8 24.89,39.73 v24.89,46.13
  Bottom 0.203: 3V3ROT.7 32.51,30.73 32.51,35.56 32.07,36 R4.1 31.7,36.54 v31.7,37.8 | v24.89,46.13 22.15,46.13 21.13,47.14 21.13,49.17 21.08,49.23 U$2.P11_GPIO17
PISCL  (via drill 0.5)
  Top 0.203: v12.19,46.02 11.28,46.94 8.94,46.94 6.3,44.3 6.3,37.19 7.47,36.02 JP3.2
  Bottom 0.203: U$2.P5_GPIO3_SCL 13.46,47.29 v12.19,46.02
PISCLK  (via drill 0.5)
  Top 0.203: v34.95,47.35 33.53,48.77 14.02,48.77 13.41,48.16 8.33,48.16 5.08,44.91 5.08,34.75 5.69,34.14 5.69,32.11 6.1,31.7 6.1,29.82 JP3.5
  Bottom 0.203: U$2.P23_GPIO11_SPI0_SCLK 36.32,48.62 v34.95,47.35
PISDA  (via drill 0.5)
  Top 0.203: v9.65,46.02 9.65,40.74 7.52,38.61 JP3.1
  Bottom 0.203: U$2.P3_GPIO2_SDA 10.92,47.29 v9.65,46.02
PRX  (via drill 0.5)
  Top 0.203: v19.3,29.87 19.71,29.46 19.71,23.77 v19.3,23.37
  Bottom 0.203: U$2.P8_GPIO14_UART0_TXD 16,54.92 16.26,54.66 | 16.26,54.66 16.26,54.05 14.73,52.53 14.73,43.69 15.75,42.67 19.41,42.67 20.12,41.96 20.12,30.68 v19.3,29.87 | 3V3ROT.38 25.96,24.18 24.99,24.18 24.59,23.77 21.34,23.77 20.83,24.28 20.22,24.28 v19.3,23.37 | 16.26,55.27 16.26,54.66
PTX  (via drill 0.5)
  Top 0.203: v20.52,29.87 20.12,29.46 20.12,23.77 v20.52,23.37
  Bottom 0.203: U$2.P10_GPIO15_UART0_RXD 18.54,54.82 18.69,54.66 18.69,54.25 19.81,53.14 19.81,42.88 20.52,42.16 v20.52,29.87 | v20.52,23.37 25.2,23.37 25.16,23.41 3V3ROT.37
ROMSCL
  Bottom 0.203: 3V3ROT.35 24.86,21.81 20.93,17.88 20.93,8.59 23.62,5.89 JP1.14
ROMSDA
  Bottom 0.203: JP1.15 20.52,5.64 20.52,18.09 24.99,22.55 25.2,22.55 25.25,22.61 3V3ROT.36
XI
  Bottom 0.203: 3V3ROT.28 31.69,17.28 36.17,12.8 37.98,12.8 U$9.P$1
XO
  Bottom 0.203: 3V3ROT.29 30.89,18.49 30.89,13.01 30.68,12.8 29.01,12.8 U$9.P$2

### Text on the board
tPlace: A14 / A13 / A12 / A11 / A10 / A9 / A8 / A7 / A6 / A5 / A4 / A3 / A2 / A1 / A0 / GND / GND / 3V / 3V / 3V | SDA / SCL / MOSI / MISO / SCLK / CE0 / CE1 / #18 / #22 / #23 / #24 / #25 | #6 / #13 / #19 / #26 / #12 / #16 / #20 / #21 / GND / GND / 5V / 5V | A15 / A16 / A17 / A18 / A19 / A20 / A21 / A22 / A23 / A24 / A25 / A26 / A27 / A28 / A29 / GND / GND / 3V / 3V / 3V
tNames: Raspberry Pi GPIO | Raspberry Pi GPIO